# Altium schematic sheet TX_LPF_Add_on.SchDoc: CONN
size A3; DocumentNumber: 14; Revision: 2.0; SheetNumber: 14; SheetTotal: 18
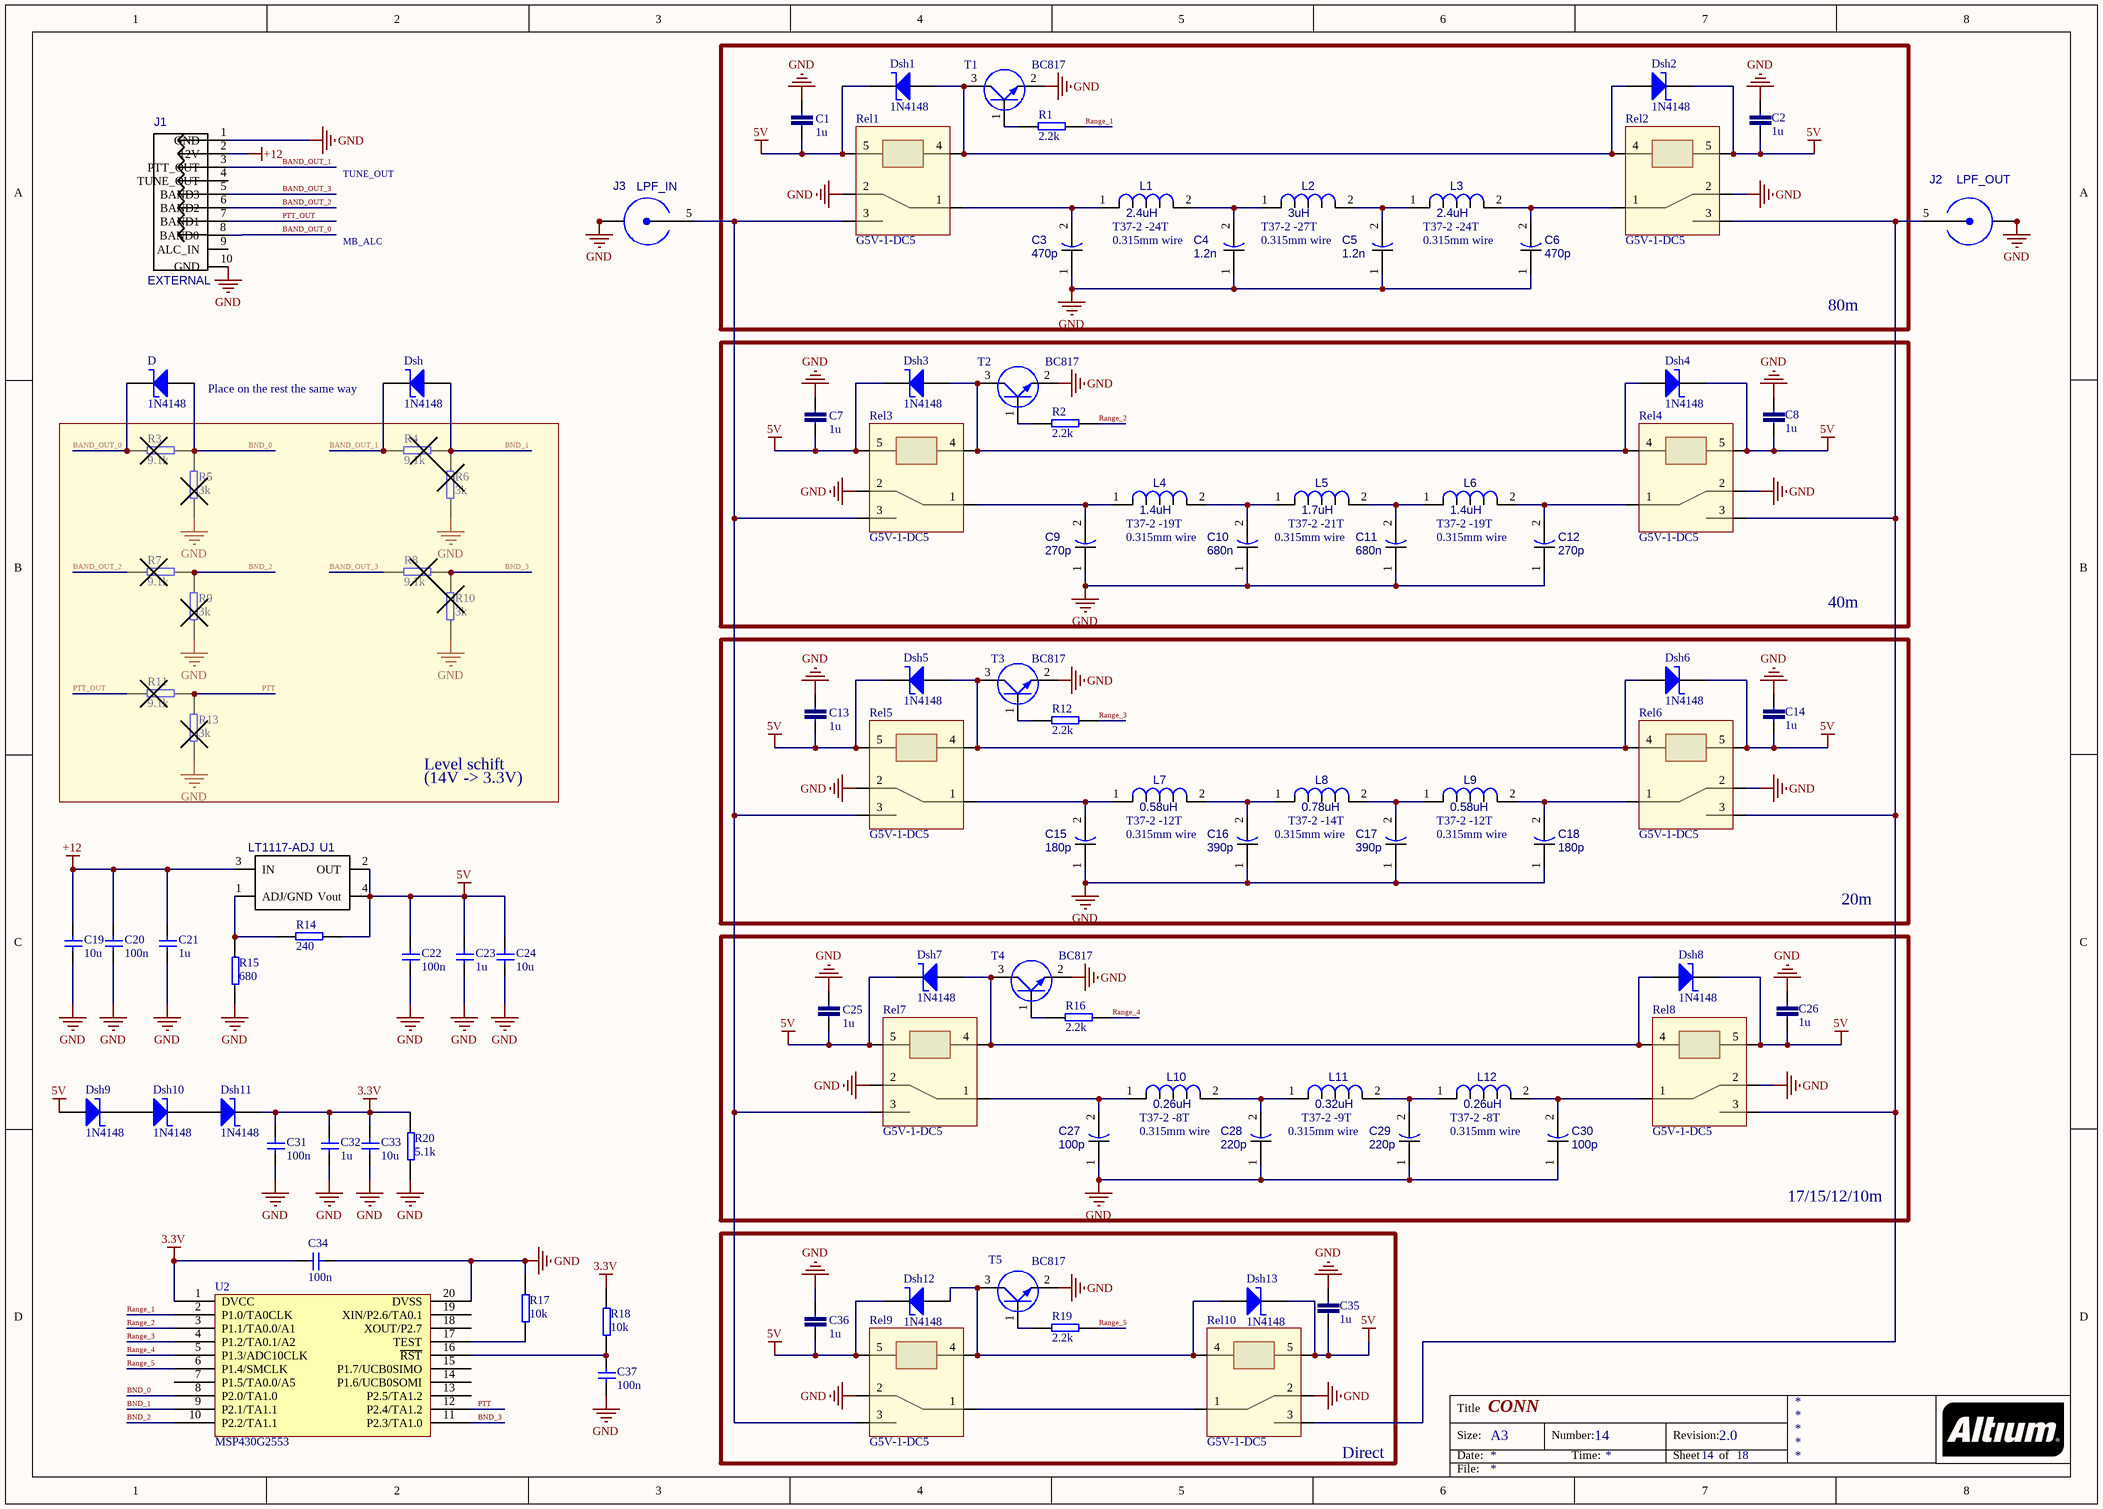
[diagram p0: TX_LPF_Add_on.SchDoc]

## Parts
C1  value 1u  [0805S]
C2  value 1u  [0805S]
C3  value 470p  [CAP_5mm]  (hidden comment: CAP_5mm)
C4  value 1.2n  [CAP_5mm]  (hidden comment: CAP_5mm)
C5  value 1.2n  [CAP_5mm]  (hidden comment: CAP_5mm)
C6  value 470p  [CAP_5mm]  (hidden comment: CAP_5mm)
C7  value 1u  [0805S]
C8  value 1u  [0805S]
C9  value 270p  [CAP_5mm]  (hidden comment: CAP_5mm)
C10  value 680n  [CAP_5mm]  (hidden comment: CAP_5mm)
C11  value 680n  [CAP_5mm]  (hidden comment: CAP_5mm)
C12  value 270p  [CAP_5mm]  (hidden comment: CAP_5mm)
C13  value 1u  [0805S]
C14  value 1u  [0805S]
C15  value 180p  [CAP_5mm]  (hidden comment: CAP_5mm)
C16  value 390p  [CAP_5mm]  (hidden comment: CAP_5mm)
C17  value 390p  [CAP_5mm]  (hidden comment: CAP_5mm)
C18  value 180p  [CAP_5mm]  (hidden comment: CAP_5mm)
C19  value 10u  [CAP_1206]  (hidden comment: C0805)
C20  value 100n  [0805S]  (hidden comment: C0805)
C21  value 1u  [0805S]  (hidden comment: C0805)
C22  value 100n  [0805S]  (hidden comment: C0805)
C23  value 1u  [0805S]  (hidden comment: C0805)
C24  value 10u  [CAP_1206]  (hidden comment: C0805)
C25  value 1u  [0805S]
C26  value 1u  [0805S]
C27  value 100p  [CAP_5mm]  (hidden comment: CAP_5mm)
C28  value 220p  [CAP_5mm]  (hidden comment: CAP_5mm)
C29  value 220p  [CAP_5mm]  (hidden comment: CAP_5mm)
C30  value 100p  [CAP_5mm]  (hidden comment: CAP_5mm)
C31  value 100n  [0805S]  (hidden comment: C0805)
C32  value 1u  [0805S]  (hidden comment: C0805)
C33  value 10u  [CAP_1206]  (hidden comment: C0805)
C34  value 100n  [0805S]  (hidden comment: C0805)
C35  value 1u  [0805S]
C36  value 1u  [0805S]
C37  value 100n  [0805S]  (hidden comment: C0805)
D  value 1N4148  [1N4148 (1005)]  (hidden comment: DIODE_Shottky_Micr.M)
Dsh  value 1N4148  [1N4148 (1005)]  (hidden comment: DIODE_Shottky_Micr.M)
Dsh1  value 1N4148  [1N4148 (1005)]  (hidden comment: DIODE_Shottky_Micr.M)
Dsh2  value 1N4148  [1N4148 (1005)]  (hidden comment: DIODE_Shottky_Micr.M)
Dsh3  value 1N4148  [1N4148 (1005)]  (hidden comment: DIODE_Shottky_Micr.M)
Dsh4  value 1N4148  [1N4148 (1005)]  (hidden comment: DIODE_Shottky_Micr.M)
Dsh5  value 1N4148  [1N4148 (1005)]  (hidden comment: DIODE_Shottky_Micr.M)
Dsh6  value 1N4148  [1N4148 (1005)]  (hidden comment: DIODE_Shottky_Micr.M)
Dsh7  value 1N4148  [1N4148 (1005)]  (hidden comment: DIODE_Shottky_Micr.M)
Dsh8  value 1N4148  [1N4148 (1005)]  (hidden comment: DIODE_Shottky_Micr.M)
Dsh9  value 1N4148  [1N4148 (1005)]  (hidden comment: DIODE_Shottky_Micr.M)
Dsh10  value 1N4148  [1N4148 (1005)]  (hidden comment: DIODE_Shottky_Micr.M)
Dsh11  value 1N4148  [1N4148 (1005)]  (hidden comment: DIODE_Shottky_Micr.M)
Dsh12  value 1N4148  [1N4148 (1005)]  (hidden comment: DIODE_Shottky_Micr.M)
Dsh13  value 1N4148  [1N4148 (1005)]  (hidden comment: DIODE_Shottky_Micr.M)
J1  EXTERNAL  [90131-0126]
J2  value LPF_OUT  [31-5431]  (hidden comment: Output)
J3  value LPF_IN  [31-5431]  (hidden comment: Input)
L1  value 2.4uH  [IND_T37-2]  (hidden comment: IND_T37-2)
L2  value 3uH  [IND_T37-2]  (hidden comment: IND_T37-2)
L3  value 2.4uH  [IND_T37-2]  (hidden comment: IND_T37-2)
L4  value 1.4uH  [IND_T37-2]  (hidden comment: IND_T37-2)
L5  value 1.7uH  [IND_T37-2]  (hidden comment: IND_T37-2)
L6  value 1.4uH  [IND_T37-2]  (hidden comment: IND_T37-2)
L7  value 0.58uH  [IND_T37-2]  (hidden comment: IND_T37-2)
L8  value 0.78uH  [IND_T37-2]  (hidden comment: IND_T37-2)
L9  value 0.58uH  [IND_T37-2]  (hidden comment: IND_T37-2)
L10  value 0.26uH  [IND_T37-2]  (hidden comment: IND_T37-2)
L11  value 0.32uH  [IND_T37-2]  (hidden comment: IND_T37-2)
L12  value 0.26uH  [IND_T37-2]  (hidden comment: IND_T37-2)
R1  value 2.2k  [0805S]
R2  value 2.2k  [0805S]
R3  value 9.1k  [0805S]  (hidden comment: R0805)
R4  value 9.1k  [0805S]  (hidden comment: R0805)
R5  value 3k  [0805S]  (hidden comment: R0805)
R6  value 3k  [0805S]  (hidden comment: R0805)
R7  value 9.1k  [0805S]  (hidden comment: R0805)
R8  value 9.1k  [0805S]  (hidden comment: R0805)
R9  value 3k  [0805S]  (hidden comment: R0805)
R10  value 3k  [0805S]  (hidden comment: R0805)
R11  value 9.1k  [0805S]  (hidden comment: R0805)
R12  value 2.2k  [0805S]
R13  value 3k  [0805S]  (hidden comment: R0805)
R14  value 240  [0805S]  (hidden comment: R0805)
R15  value 680  [0805S]  (hidden comment: R0805)
R16  value 2.2k  [0805S]
R17  value 10k  [0805S]  (hidden comment: R0805)
R18  value 10k  [0805S]  (hidden comment: R0805)
R19  value 2.2k  [0805S]
R20  value 5.1k  [0805S]  (hidden comment: R0805)
Rel1  G5V-1-DC5  [G5V-1]
Rel2  G5V-1-DC5  [G5V-1]
Rel3  G5V-1-DC5  [G5V-1]
Rel4  G5V-1-DC5  [G5V-1]
Rel5  G5V-1-DC5  [G5V-1]
Rel6  G5V-1-DC5  [G5V-1]
Rel7  G5V-1-DC5  [G5V-1]
Rel8  G5V-1-DC5  [G5V-1]
Rel9  G5V-1-DC5  [G5V-1]
Rel10  G5V-1-DC5  [G5V-1]
T1  value BC817  [SOT-23]  (hidden comment: NPN)
T2  value BC817  [SOT-23]  (hidden comment: NPN)
T3  value BC817  [SOT-23]  (hidden comment: NPN)
T4  value BC817  [SOT-23]  (hidden comment: NPN)
T5  value BC817  [SOT-23]  (hidden comment: NPN)
U1  value LT1117-ADJ  [LT1117IST-ADJ]  (hidden comment: LT1117IST-ADJ)
U2  MSP430G2553  [DIP20M]

## Blocks framed on the sheet
80m: C1-C6 Dsh1 Dsh2 L1-L3 R1 Rel1 Rel2 T1
40m: C7-C12 Dsh3 Dsh4 L4-L6 R2 Rel3 Rel4 T2
20m: C13-C18 Dsh5 Dsh6 L7-L9 R12 Rel5 Rel6 T3
17/15/12/10m: C25-C30 Dsh7 Dsh8 L10-L12 R16 Rel7 Rel8 T4
Direct: C35 C36 Dsh12 Dsh13 R19 Rel9 Rel10 T5

## Nets
3.3V: C31.2 C32.2 C33.2 C34.1 Dsh11.K R18.1 R20.1 U2.1(DVCC)
5V: C1.1 C2.2 C7.1 C8.2 C13.1 C14.2 C22.2 C23.2 C24.2 C25.1 C26.2 C35.2 C36.1 Dsh1.K Dsh2.K Dsh3.K Dsh4.K Dsh5.K Dsh6.K Dsh7.K Dsh8.K Dsh9.A Dsh12.K Dsh13.K R14.2 Rel1.5 Rel2.5 Rel3.5 Rel4.5 Rel5.5 Rel6.5 Rel7.5 Rel8.5 Rel9.5 Rel10.5 U1.2(OUT) U1.4(Vout)
+12: C19.2 C20.2 C21.2 J1.2(12V) U1.3(IN)
GND: C1.2 C2.1 C3.1 C4.1 C5.1 C6.1 C7.2 C8.1 C9.1 C10.1 C11.1 C12.1 C13.2 C14.1 C15.1 C16.1 C17.1 C18.1 C19.1 C20.1 C21.1 C22.1 C23.1 C24.1 C25.2 C26.1 C27.1 C28.1 C29.1 C30.1 C31.1 C32.1 C33.1 C34.2 C35.1 C36.2 C37.1 J1.1(GND) J1.10(GND) J2.1(GND) J2.2(GND) J2.3(GND) J2.4(GND) J3.1(GND) J3.2(GND) J3.3(GND) J3.4(GND) R5.1 R6.1 R9.1 R10.1 R13.1 R15.2 R17.1 R20.2 Rel1.2 Rel2.2 Rel3.2 Rel4.2 Rel5.2 Rel6.2 Rel7.2 Rel8.2 Rel9.2 Rel10.2 T1.2 T2.2 T3.2 T4.2 T5.2 U2.20(DVSS)
BAND_OUT_0: D.K J1.8(BAND0) R3.1
BAND_OUT_1: Dsh.K J1.3(PTT_OUT) R4.1
BAND_OUT_2: J1.6(BAND2) R7.1
BAND_OUT_3: J1.5(BAND3) R8.1
BND_0: D.A R3.2 R5.2 U2.8(P2.0/TA1.0)
BND_1: Dsh.A R4.2 R6.2 U2.9(P2.1/TA1.1)
BND_2: R7.2 R9.2 U2.10(P2.2/TA1.1)
BND_3: R8.2 R10.2 U2.11(P2.3/TA1.0)
PTT: R11.2 R13.2 U2.12(P2.4/TA1.2)
PTT_OUT: J1.7(BAND1) R11.1
Range_1: R1.2 U2.2(P1.0/TA0CLK)
Range_2: R2.2 U2.3(P1.1/TA0.0/A1)
Range_3: R12.2 U2.4(P1.2/TA0.1/A2)
Range_4: R16.2 U2.5(P1.3/ADC10CLK)
Range_5: R19.2 U2.6(P1.4/SMCLK)
NetC3_2: C3.2 L1.1 Rel1.1
NetC4_2: C4.2 L1.2 L2.1
NetC5_2: C5.2 L2.2 L3.1
NetC6_2: C6.2 L3.2 Rel2.1
NetC9_2: C9.2 L4.1 Rel3.1
NetC10_2: C10.2 L4.2 L5.1
NetC11_2: C11.2 L5.2 L6.1
NetC12_2: C12.2 L6.2 Rel4.1
NetC15_2: C15.2 L7.1 Rel5.1
NetC16_2: C16.2 L7.2 L8.1
NetC17_2: C17.2 L8.2 L9.1
NetC18_2: C18.2 L9.2 Rel6.1
NetC27_2: C27.2 L10.1 Rel7.1
NetC28_2: C28.2 L10.2 L11.1
NetC29_2: C29.2 L11.2 L12.1
NetC30_2: C30.2 L12.2 Rel8.1
NetC37_2: C37.2 R18.2 U2.16(~{RST})
NetDsh1_A: Dsh1.A Dsh2.A Rel1.4 Rel2.4 T1.3
NetDsh3_A: Dsh3.A Dsh4.A Rel3.4 Rel4.4 T2.3
NetDsh5_A: Dsh5.A Dsh6.A Rel5.4 Rel6.4 T3.3
NetDsh7_A: Dsh7.A Dsh8.A Rel7.4 Rel8.4 T4.3
NetDsh9_K: Dsh9.K Dsh10.A
NetDsh10_K: Dsh10.K Dsh11.A
NetDsh12_A: Dsh12.A Dsh13.A Rel9.4 Rel10.4 T5.3
NetJ2_5: J2.5(CON) Rel2.3 Rel4.3 Rel6.3 Rel8.3 Rel10.3
NetJ3_5: J3.5(CON) Rel1.3 Rel3.3 Rel5.3 Rel7.3 Rel9.3
NetR1_1: R1.1 T1.1
NetR2_1: R2.1 T2.1
NetR12_1: R12.1 T3.1
NetR14_1: R14.1 R15.1 U1.1(ADJ/GND)
NetR16_1: R16.1 T4.1
NetR17_2: R17.2 U2.17(TEST)
NetR19_1: R19.1 T5.1
NetRel9_1: Rel9.1 Rel10.1

Not connected (* = marked no-connect by the designer): J1 4(TUNE_OUT) 9(ALC_IN); U2 7(P1.5/TA0.0/A5) 13(P2.5/TA1.2) 14(P1.6/UCB0SOMI) 15(P1.7/UCB0SIMO) 18(XOUT/P2.7) 19(XIN/P2.6/TA0.1)

## Notes on the sheet
- TUNE_OUT
- MB_ALC
- (near L1) T37-2 -24T
- 0.315mm wire
- (near L2) T37-2 -27T
- (near L3) T37-2 -24T
- (near Dsh) Place on the rest the same way
- (near L4) T37-2 -19T
- (near L5) T37-2 -21T
- (near L6) T37-2 -19T
- Level schift
- (14V -> 3.3V)
- (near L7) T37-2 -12T
- (near L8) T37-2 -14T
- (near L9) T37-2 -12T
- (near L10) T37-2 -8T
- (near L11) T37-2 -9T
- (near L12) T37-2 -8T
- Title
- Size:
- Date:
- A3
- Number:
- Time:
- Revision:
- Sheet
- of
- File:

## Library data of the parts
C1 C2 C7 C8 C13 C14 C25 C26 C35 C36 = C-EUC0805: Capacitor
C3-C6 C9-C12 C15-C18 C27-C30 = CAP_5mm: CAP_1206
C19-C24 C31-C34 C37 = C0805: Capacitor
D Dsh Dsh1-Dsh13 = DIODE_Shottky_Micr.M: Diode Shottky
J1 = 90131-0126: 2*5 PIN; Value: *
J2 J3 = 31-5431: SMA
R1-R20 = R0805: Resistor
T1-T5 = NPN: Bipol. Transistor